# Altium schematic sheet HDMI.SchDoc
size A3; PageSetup: Record=PageOptions|CenterHorizontal=True|CenterVertical=True|PrintScale=0.95|XCorrection=1.00|YCorrection=1.00|PrintKind=0|BorderSize=5000000|LeftOffset=0|BottomOffset=0|Orientation=2|PaperLength=1000|PaperWidth=1000|Scale=100|PaperSource=7|PrintQuality=-4|MediaType=1|DitherType=10|PaperKind=A3 297x420mm|PrintScaleMode=1; Organization: Electronic Research & Design; Address1: 11 Granofier; Address2: Zwartkop; Address3: Centurion; Address4: South Africa
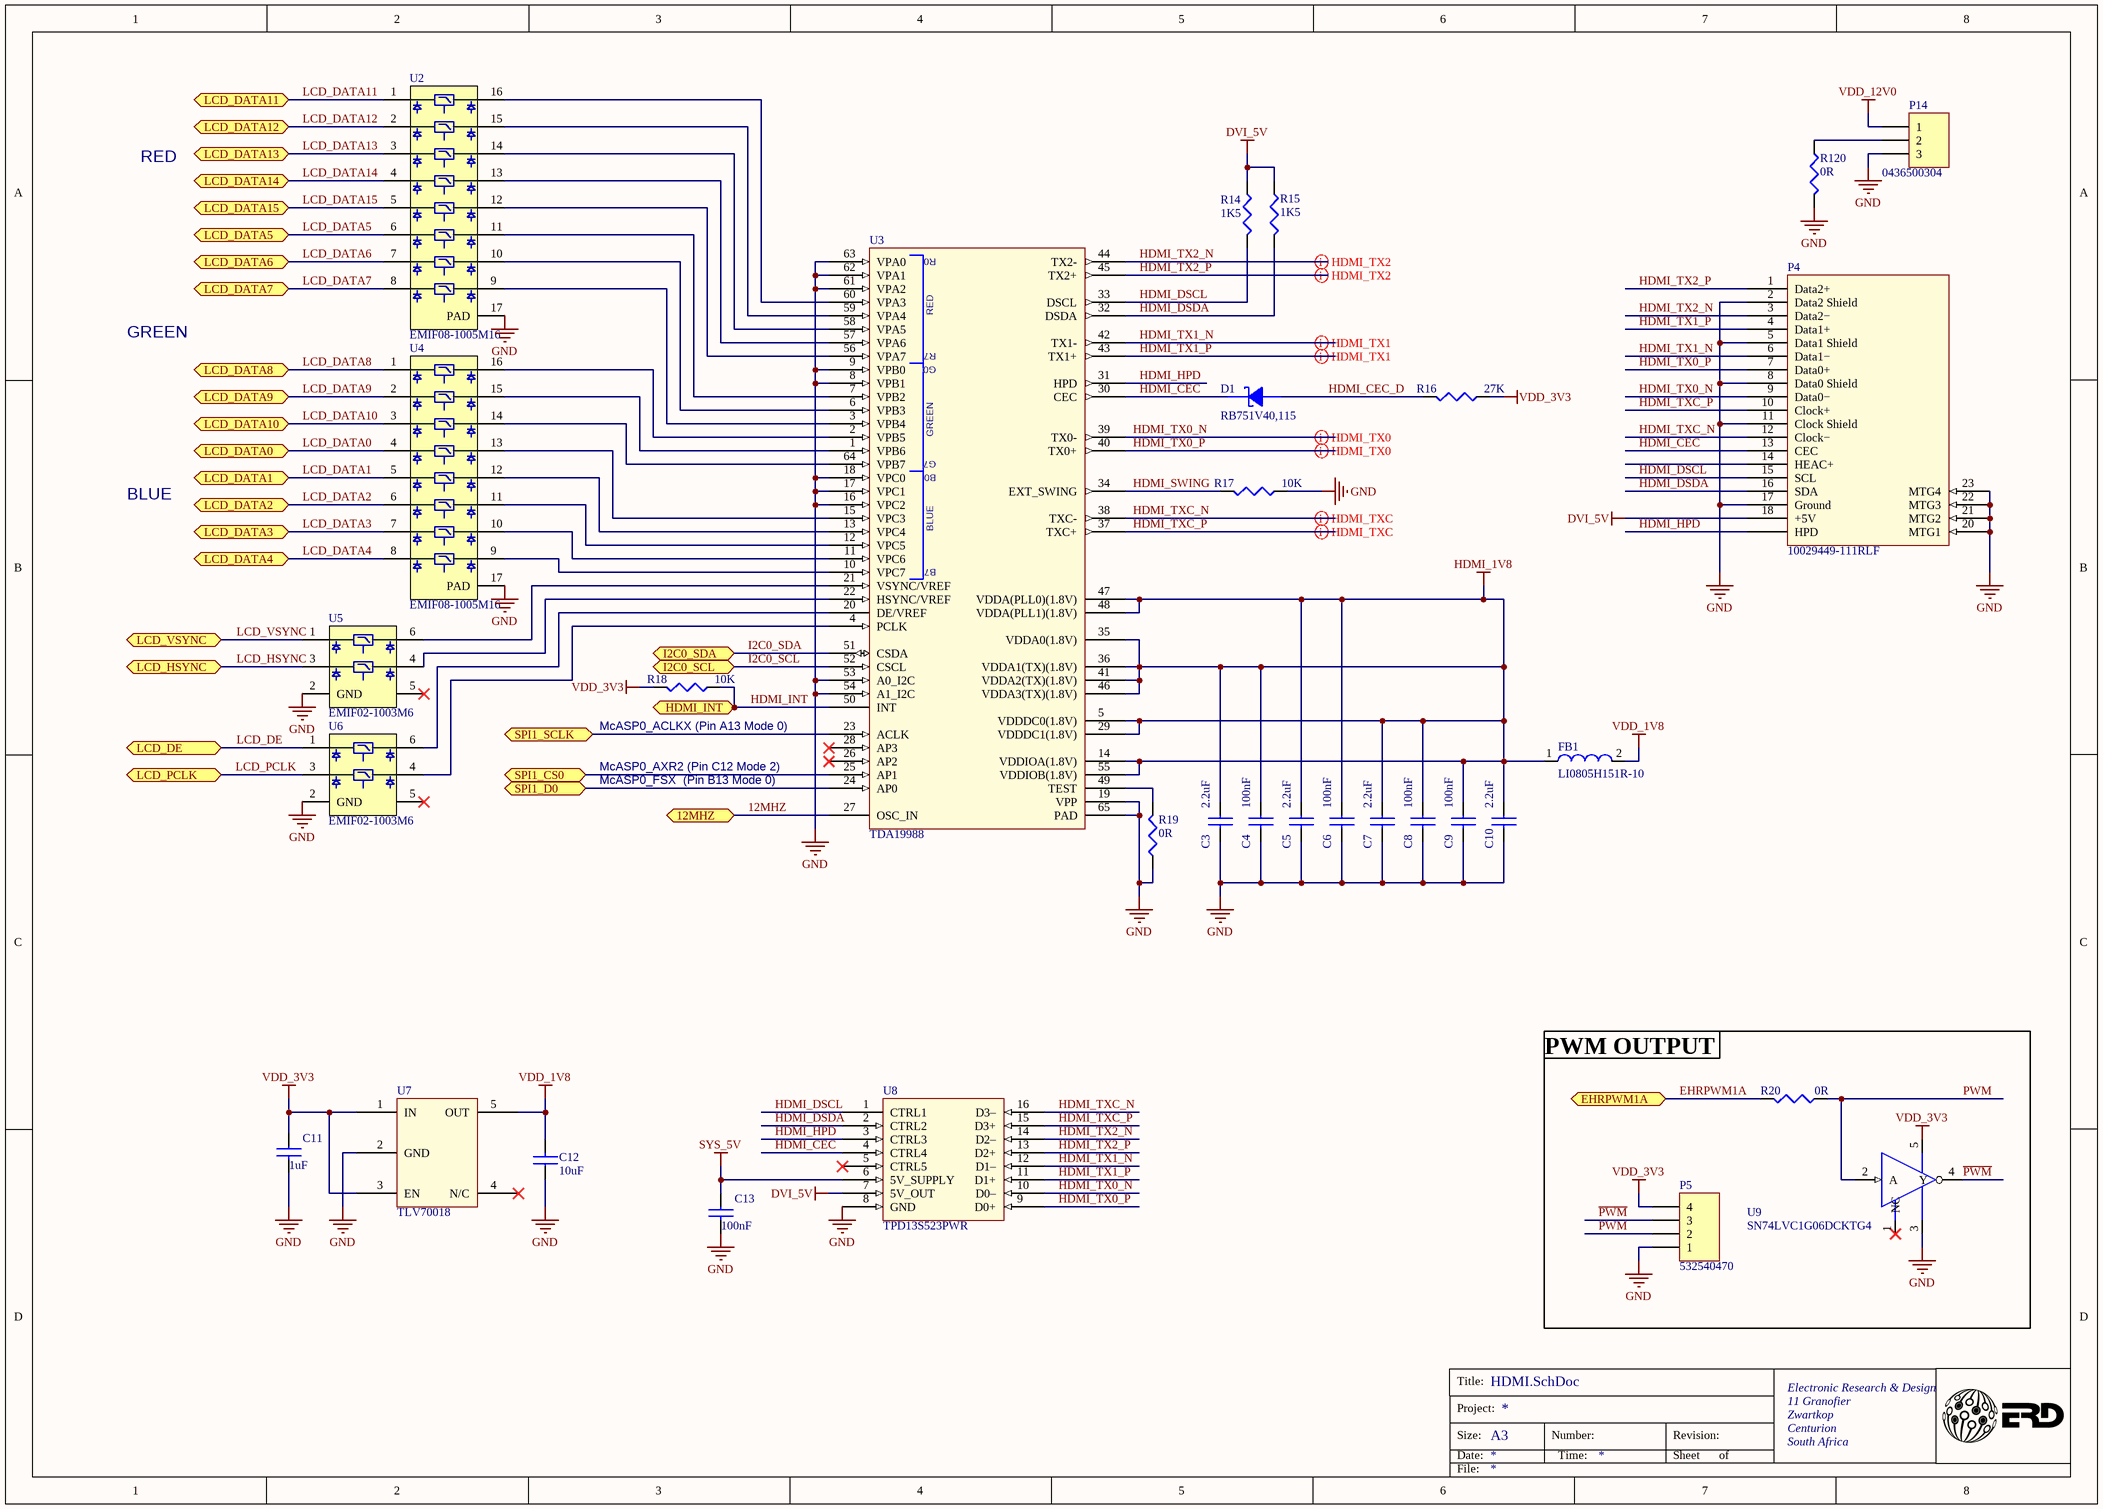
[diagram p0: HDMI.SchDoc]

## Parts
C3  2.2uF  [CC0402]
C4  100nF  [CC0402]
C5  2.2uF  [CC0402]
C6  100nF  [CC0402]
C7  2.2uF  [CC0402]
C8  100nF  [CC0402]
C9  100nF  [CC0402]
C10  2.2uF  [CC0402]
C11  1uF  [CC0402]
C12  10uF  [CC0603]
C13  100nF  [CC0402]
D1  RB751V40,115  [SOD323]
FB1  LI0805H151R-10  [RC0805]
P4  10029449-111RLF
P5  532540470  [HDR1X4]
P14  0436500304  [HDR1X3]
R14  1K5  [RC0402]
R15  1K5  [RC0402]
R16  27K  [RC0402]
R17  10K  [RC0402]
R18  10K  [RC0402]
R19  0R  [RC0402]
R20  0R  [RC0402]
R120  0R  [RC0402]
U2  EMIF08-1005M16  [QFN-16L]
U3  TDA19988  [QFN64S9X9P5]
U4  EMIF08-1005M16  [QFN-16L]
U5  EMIF02-1003M6  [uQFN-6L]
U6  EMIF02-1003M6  [uQFN-6L]
U7  TLV70018  [SC-70-5]
U8  TPD13S523PWR
U9  SN74LVC1G06DCKTG4  [DCK5_2P15X1P4]

## Ports
12MHZ, EHRPWM1A, HDMI_INT, I2C0_SCL, I2C0_SDA, LCD_DATA0, LCD_DATA1, LCD_DATA2, LCD_DATA3, LCD_DATA4, LCD_DATA5, LCD_DATA6, LCD_DATA7, LCD_DATA8, LCD_DATA9, LCD_DATA10, LCD_DATA11, LCD_DATA12, LCD_DATA13, LCD_DATA14, LCD_DATA15, LCD_DE, LCD_HSYNC, LCD_PCLK, LCD_VSYNC, SPI1_CS0, SPI1_D0, SPI1_SCLK

## Nets
DVI_5V: P4.18(+5V) R14.1 R15.1 U8.7(5V_OUT)
GND: C3.2 C4.2 C5.2 C6.2 C7.2 C8.2 C9.2 C10.2 C11.2 C12.1 C13.2 P4.2(Data2_Shield) P4.5(Data1_Shield) P4.8(Data0_Shield) P4.11(Clock_Shield) P4.17(Ground) P4.20(MTG1) P4.21(MTG2) P4.22(MTG3) P4.23(MTG4) P5.1 P14.3 R17.1 R19.1 R120.1 U2.17(PAD) U3.8(VPB1) U3.9(VPB0) U3.16(VPC2) U3.17(VPC1) U3.18(VPC0) U3.19(VPP) U3.53(A0_I2C) U3.54(A1_I2C) U3.61(VPA2) U3.62(VPA1) U3.63(VPA0) U3.65(PAD) U4.17(PAD) U5.2(GND) U6.2(GND) U7.2(GND) U8.8(GND) U9.3(GND)
HDMI_1V8: C3.1 C4.1 C5.1 C6.1 C7.1 C8.1 C9.1 C10.1 FB1.1 U3.5(VDDDC0(1.8V)) U3.14(VDDIOA(1.8V)) U3.29(VDDDC1(1.8V)) U3.35(VDDA0(1.8V)) U3.36(VDDA1(TX)(1.8V)) U3.41(VDDA2(TX)(1.8V)) U3.46(VDDA3(TX)(1.8V)) U3.47(VDDA(PLL0)(1.8V)) U3.48(VDDA(PLL1)(1.8V)) U3.55(VDDIOB(1.8V))
SYS_5V: C13.1 U8.6(5V_SUPPLY)
VDD_1V8: C12.2 FB1.2 U7.5(OUT)
VDD_3V3: C11.1 P5.4 R16.1 R18.2 U7.1(IN) U7.3(EN) U9.5(VCC)
VDD_12V0: P14.1
12MHZ: U3.27(OSC_IN) ; port 12MHZ
EHRPWM1A: R20.2 ; port EHRPWM1A
HDMI_CEC: D1.1(C) P4.13(CEC) U3.30(CEC) U8.4(CTRL4)
HDMI_CEC_D: D1.2(A) R16.2
HDMI_DSCL: P4.15(SCL) R14.2 U3.33(DSCL) U8.1(CTRL1)
HDMI_DSDA: P4.16(SDA) R15.2 U3.32(DSDA) U8.2(CTRL2)
HDMI_HPD: P4.?1(HPD) U3.31(HPD) U8.3(CTRL3)
HDMI_INT: R18.1 U3.50(INT) ; port HDMI_INT
HDMI_SWING: R17.2 U3.34(EXT_SWING)
HDMI_TX0_N: P4.9(Data0−) U3.39(TX0-) U8.10(D0–)
HDMI_TX0_P: P4.7(Data0+) U3.40(TX0+) U8.9(D0+)
HDMI_TX1_N: P4.6(Data1−) U3.42(TX1-) U8.12(D1–)
HDMI_TX1_P: P4.4(Data1+) U3.43(TX1+) U8.11(D1+)
HDMI_TX2_N: P4.3(Data2−) U3.44(TX2-) U8.14(D2–)
HDMI_TX2_P: P4.1(Data2+) U3.45(TX2+) U8.13(D2+)
HDMI_TXC_N: P4.12(Clock−) U3.38(TXC-) U8.16(D3–)
HDMI_TXC_P: P4.10(Clock+) U3.37(TXC+) U8.15(D3+)
I2C0_SCL: U3.52(CSCL) ; port I2C0_SCL
I2C0_SDA: U3.51(CSDA) ; port I2C0_SDA
LCD_DATA0: U4.4 ; port LCD_DATA0
LCD_DATA1: U4.5 ; port LCD_DATA1
LCD_DATA2: U4.6 ; port LCD_DATA2
LCD_DATA3: U4.7 ; port LCD_DATA3
LCD_DATA4: U4.8 ; port LCD_DATA4
LCD_DATA5: U2.6 ; port LCD_DATA5
LCD_DATA6: U2.7 ; port LCD_DATA6
LCD_DATA7: U2.8 ; port LCD_DATA7
LCD_DATA8: U4.1 ; port LCD_DATA8
LCD_DATA9: U4.2 ; port LCD_DATA9
LCD_DATA10: U4.3 ; port LCD_DATA10
LCD_DATA11: U2.1 ; port LCD_DATA11
LCD_DATA12: U2.2 ; port LCD_DATA12
LCD_DATA13: U2.3 ; port LCD_DATA13
LCD_DATA14: U2.4 ; port LCD_DATA14
LCD_DATA15: U2.5 ; port LCD_DATA15
LCD_DE: U6.1 ; port LCD_DE
LCD_HSYNC: U5.3 ; port LCD_HSYNC
LCD_PCLK: U6.3 ; port LCD_PCLK
LCD_VSYNC: U5.1 ; port LCD_VSYNC
~{PWM}: P5.3 U9.4(Y)
PWM: P5.2 R20.1 U9.2(A)
SPI1_CS0: U3.25(AP1) ; port SPI1_CS0
SPI1_D0: U3.24(AP0) ; port SPI1_D0
SPI1_SCLK: U3.23(ACLK) ; port SPI1_SCLK
NetP14_2: P14.2 R120.2
NetR19_2: R19.2 U3.49(TEST)
NetU2_9: U2.9 U3.3(VPB4)
NetU2_10: U2.10 U3.6(VPB3)
NetU2_11: U2.11 U3.7(VPB2)
NetU2_12: U2.12 U3.56(VPA7)
NetU2_13: U2.13 U3.57(VPA6)
NetU2_14: U2.14 U3.58(VPA5)
NetU2_15: U2.15 U3.59(VPA4)
NetU2_16: U2.16 U3.60(VPA3)
NetU3_1: U3.1(VPB6) U4.15
NetU3_2: U3.2(VPB5) U4.16
NetU3_4: U3.4(PCLK) U6.4
NetU3_10: U3.10(VPC7) U4.9
NetU3_11: U3.11(VPC6) U4.10
NetU3_12: U3.12(VPC5) U4.11
NetU3_13: U3.13(VPC4) U4.12
NetU3_15: U3.15(VPC3) U4.13
NetU3_20: U3.20(DE/VREF) U6.6
NetU3_21: U3.21(VSYNC/VREF) U5.6
NetU3_22: U3.22(HSYNC/VREF) U5.4
NetU3_64: U3.64(VPB7) U4.14

Not connected (* = marked no-connect by the designer): P4 14(HEAC+); U3 26(AP2)* 28(AP3)*; U5 5(GND)*; U6 5(GND)*; U7 4(N/C)*; U8 5(CTRL5)*; U9 1(NC)*

## Layout directives
differential pair: HDMI_TX0_N, HDMI_TX0_P, HDMI_TX1_N, HDMI_TX1_P, HDMI_TX2_N, HDMI_TX2_P, HDMI_TXC_N, HDMI_TXC_P

## Notes on the sheet
- RED
- GREEN
- BLUE
- (near R18) McASP0_ACLKX (Pin A13 Mode 0)
- McASP0_AXR2 (Pin C12 Mode 2)
- McASP0_FSX  (Pin B13 Mode 0)
- PWM OUTPUT
- Title:
- Size:
- Date:
- Project:
- A3
- Number:
- Time:
- Revision:
- Sheet
- of
- File:
- (in symbol TDA19988) R0; RED; R7; G0; GREEN; G7; B0; BLUE; B7

## Library data of the parts
C3 C5 C7 C10 = CAP CER 0.1UF 10V 10% X5R 0402: CAP CER 2.2UF 6.3V 10% X5R 0402; Manufacturer: TDK; Part Number: C1005X5R0J225K050BC; Package / Case: 0402 (1005 Metric); Supplier: AAD
C4 C6 C8 C9 C13 = CAP CER 0.1UF 10V 10% X5R 0402: CAP CER 0.1UF 50V 10% X7R 0402; Manufacturer: Murata; Part Number: GCM155R71H104KE02D; Package / Case: 0402 (1005 Metric); Supplier: AAD
C11 = CAP CER 0.1UF 10V 10% X5R 0402: CAP CER 1UF 10V 20% X5R 0402; Manufacturer: Murata; Part Number: GRM153R61A105ME95D; Package / Case: 0402 (1005 Metric); Supplier: AAD
C12 = CAP CER 0.1UF 10V 10% X5R 0402: CAP CER 10UF 25V 20% X5R 0603; Manufacturer: Murata; PartNumber: GRM188R61E106MA73D; Package / Case: 0603; Supplier: AAD
D1 = Zener: DIODE SCHOTTKY 40V 120MA SOD323; Manufacturer: NXP Semiconductors; Current - Average Rectified (Io): 120mA (DC); Voltage - Forward (Vf) (Max) @ If: 370mV @ 1mA; Speed: Small Signal =< 200mA (Io), Any Speed; Current - Reverse Leakage @ Vr: 500nA @ 30V; Capacitance @ Vr, F: 2pF @ 1V, 1MHz; Supplier 1: Digi-Key; Supplier Part Number 1: 568-8119-6-ND; Manufacturer Part Number: RB751V40,115; RoHS: RoHS Compliant; Category: Discrete Semiconductor Products; Stock 1: 5326; Pricing 1: 1=0.29, 10=0.26, 25=0.1872, 100=0.1456, 250=0.09152, 500=0.07798, 1000=0.05313 (USD); Diode Type: Schottky; Voltage - DC Reverse (Vr) (Max): 40V; Reverse Recovery Time (trr): -; Mounting Type: Surface Mount; Package / Case: SC-76, SOD-323; Supplier Device Package: SOD-323; Packaging: Digi-Reel®; ComponentLink1URL: http://www.nxp.com/documents/data_sheet/RB751_SER.pdf; ComponentLink1Description: http://www.nxp.com/documents/data_sheet/RB751_SER.pdf
FB1 = FER_180_200_0: FERRITE, 800mA, 150mOHM, 0805; Manufacturer: Laird; PartNumber: LI0805H151R-10
P4 = 10029449-111RLF: CONN RCPT 1.4 HDMI 19POS SMD R/A
P5 = Header 4: Header, RA, 4-circuit, 2mm pitch, TH; Manufacturer: Molex; PartNumber: 532540470
P14 = Header 3: Header, MicroFit, RA, 3-circuit, 3mm pitch, TH; Manufacturer: Molex; Mating Part: 0436450300; PartNumber: 0436500304
R14 R15 = RES_10K_1/16W_1%_0402: RES, 1K5 OHM, 1/16W, 1%, 0402; Manufacturer: Yageo; PartNumber: RC0402FR-071K5L; Package / Case: 0402 (1005 Metric); Supplier: AAD
R16 = RES_10K_1/16W_1%_0402: RES, 27K OHM, 1/16W, 1%, 0402; Manufacturer: Yageo; PartNumber: RC0402FR-0727KL; Package / Case: 0402 (1005 Metric); Supplier: AAD
R17 R18 = RES_10K_1/16W_1%_0402: RES, 10K OHM, 1/16W, 1%, 0402; Manufacturer: Yageo; PartNumber: RC0402FR-0710KL; Package / Case: 0402 (1005 Metric); Supplier: AAD
R19 R20 R120 = RES_10K_1/16W_1%_0402: RES, 0 OHM, 1/16W, 1%, 0402; Manufacturer: Yageo; PartNumber: RC0402FR-070RL; Package / Case: 0402 (1005 Metric); Supplier: AAD
U2 U4 = EMIF08-1005M16: EMI Filter, ESD, QFN-16L; PartNumber: EMIF08-1005M16
U3 = TDA19988: IC HDMI TRANSMITTER 64-HVQFN; Manufacturer: NXP Semiconductors; Manufacturer Part Number: TDA19988AHN/C1,551; Supplier 1: Digi-Key; Supplier Part Number 1: TDA19988AHN/C1,551-ND; RoHS: RoHS Compliant; Category: Integrated Circuits (ICs); Stock 1: 0; Pricing 1: 260=4.59 (USD); Type: HDMI Transmitter; Applications: Set-Top Boxes; Mounting Type: Surface Mount; Package / Case: 64-VFQFN Exposed Pad; Supplier Device Package: 64-HVQFN (9x9); Packaging: Tray
U5 U6 = EMIF02-1003M6: EMI Filter, ESD, uQFN-6; PartNumber: EMIF02-1003M6
U7 = TLV700: 200mA LOW DROPOUT REGULATOR
U8 = TPD13S523: TPD13S523 13-Channel ESD Protection Solution With Current-Limit Load Switch For  HDMI Transmitter Ports
U9 = SN74LVC1G04DCK: IC INVERTER SINGLE 1INPUT, SC70-5; Manufacturer: Texas Instruments; PartNumber: SN74LVC1G06DCKTG4; Package / Case: 6-TSSOP (5 Lead), SC-88A, SOT-353; Supplier: AAD; Supplier Stock Code: N/A